# EAGLE design ember_power_v2 (EAGLE 5.11)
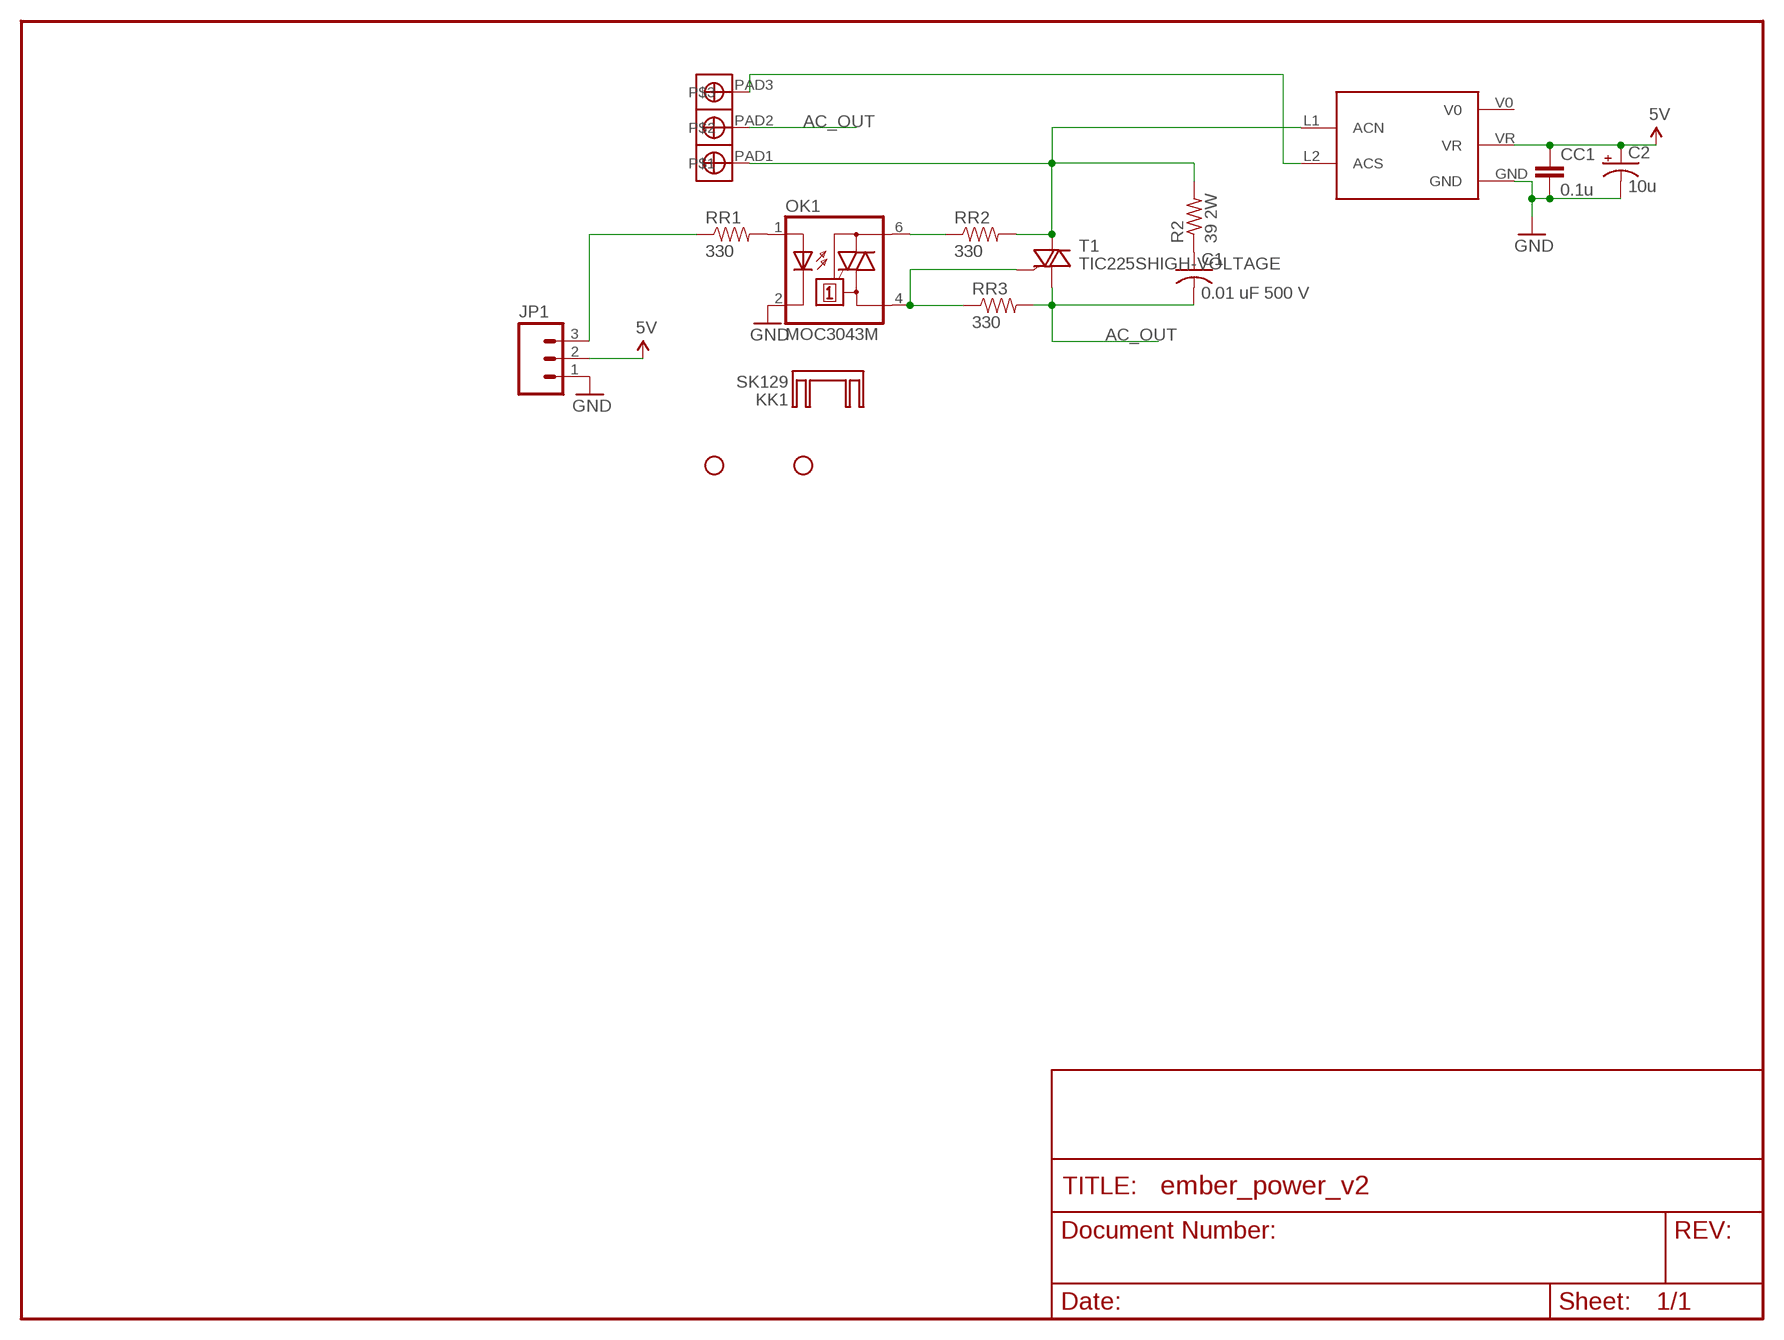
[diagram p0: schematic, sheet 1]

## Parts
C1  0.01 uF 500 V  C-US102-043X133  [C102-043X133]
C2  10u  CAP_POLPTH2  [CPOL-RADIAL-10UF-25V]
CC1  0.1u  CAPPTH  [CAP-PTH-SMALL]
JP1  M03LOCK  [1X03_LOCK]
JP5  STAND-OFF  [STAND-OFF]
JP6  STAND-OFF  [STAND-OFF]
KK1  SK129  [SK129-HOLE]
OK1  MOC3043M  [DIL06]
R2  39 2W  R-US_0411/15  [0411/15]
RR1  330  RESISTORPTH-1/4W  [AXIAL-0.4]
RR2  330  RESISTORPTH-1/4W  [AXIAL-0.4]
RR3  330  RESISTORPTH-1/4W  [AXIAL-0.4]
T1  TIC225SHIGH-VOLTAGE  [TO220DSH]
U$2  TE-BARRIER-3  [TE-BARRIER-.325]
U$3  POWER_SUPPLY  [BIAS_PWR_1W]

## Nets
5V: C2.1(+) CC1.1 JP1.2 U$3.VR
AC_OUT: C1.2 RR3.P$2 T1.A1 U$2.PAD2
GND: C2.2(-) CC1.2 JP1.1 OK1.2(C) U$3.GND
N$1: JP1.3 RR1.P$1
N$2: U$2.PAD3 U$3.L2(ACS)
N$3: OK1.1(A) RR1.P$2
N$4: OK1.6(A2) RR2.P$1
N$14: OK1.4(A1) RR3.P$1 T1.G
N$17: C1.1 R2.1
N$38 [1A/150]: R2.2 RR2.P$2 T1.A2 U$2.PAD1 U$3.L1(ACN)
Unconnected: U$3.V0

## Library data of the parts
C1 = rcl:C-US: CAPACITOR, American symbol
C2 = SparkFun:CAP_POL: Capacitor Polarized These are standard SMD and PTH capacitors. Normally 10uF, 47uF, and 100uF in electrolytic and tantalum varieties. Always verify the external diameter of the through hole cap, it varies with capacity, voltage, and manufacturer. The EIA devices should be standard.
CC1 = SparkFun:CAP: Capacitor Standard 0603 ceramic capacitor, and 0.1" leaded capacitor.
JP1 = SparkFun:M03: Header 3 Standard 3-pin 0.1" header. Use with straight break away headers (SKU : PRT-00116), right angle break away headers (PRT-00553), swiss pins (PRT-00743), machine pins (PRT-00117), and female headers (PRT-00115). Molex polarized connector foot print use with SKU : PRT-08232 with associated crimp pins and housings.
JP5 JP6 = SparkFun:STAND-OFF: Stand Off This is the mechanical footprint for a #4 phillips button head screw. Use the keepout ring to avoid running the screw head into surrounding components. SKU : PRT-00447
KK1 = heatsink:SK129: HEATSINK manufacturer Fischer/distributor Buerklin
OK1 = optocoupler:MOC30*: 6-Pin DIP Zero-Cross Optoisolators Triac Driver Output (250/400 Volt Peak) Source: http://www.fairchildsemi.com/ds/MO/MOC3043-M.pdf; MF: FAIRCHILD SEMICONDUCTOR; MPN: MOC3043-M; OC_FARNELL: 1021371; OC_NEWARK: 72K8900
R2 = User:R-US_: RESISTOR, American symbol
RR1-RR3 = SparkFun:RESISTOR: Resistor Basic schematic elements and footprints for 0603, 1206, and PTH resistors.
T1 = User:TIC225S: TRIAC
U$2 = User:TE-BARRIER-3
U$3 = User:POWER_SUPPLY

## Net classes
1 10A/150: width 2.54 mm, clearance 1.854 mm
2 1A/150: width 0.102 mm, clearance 1.854 mm

## Board
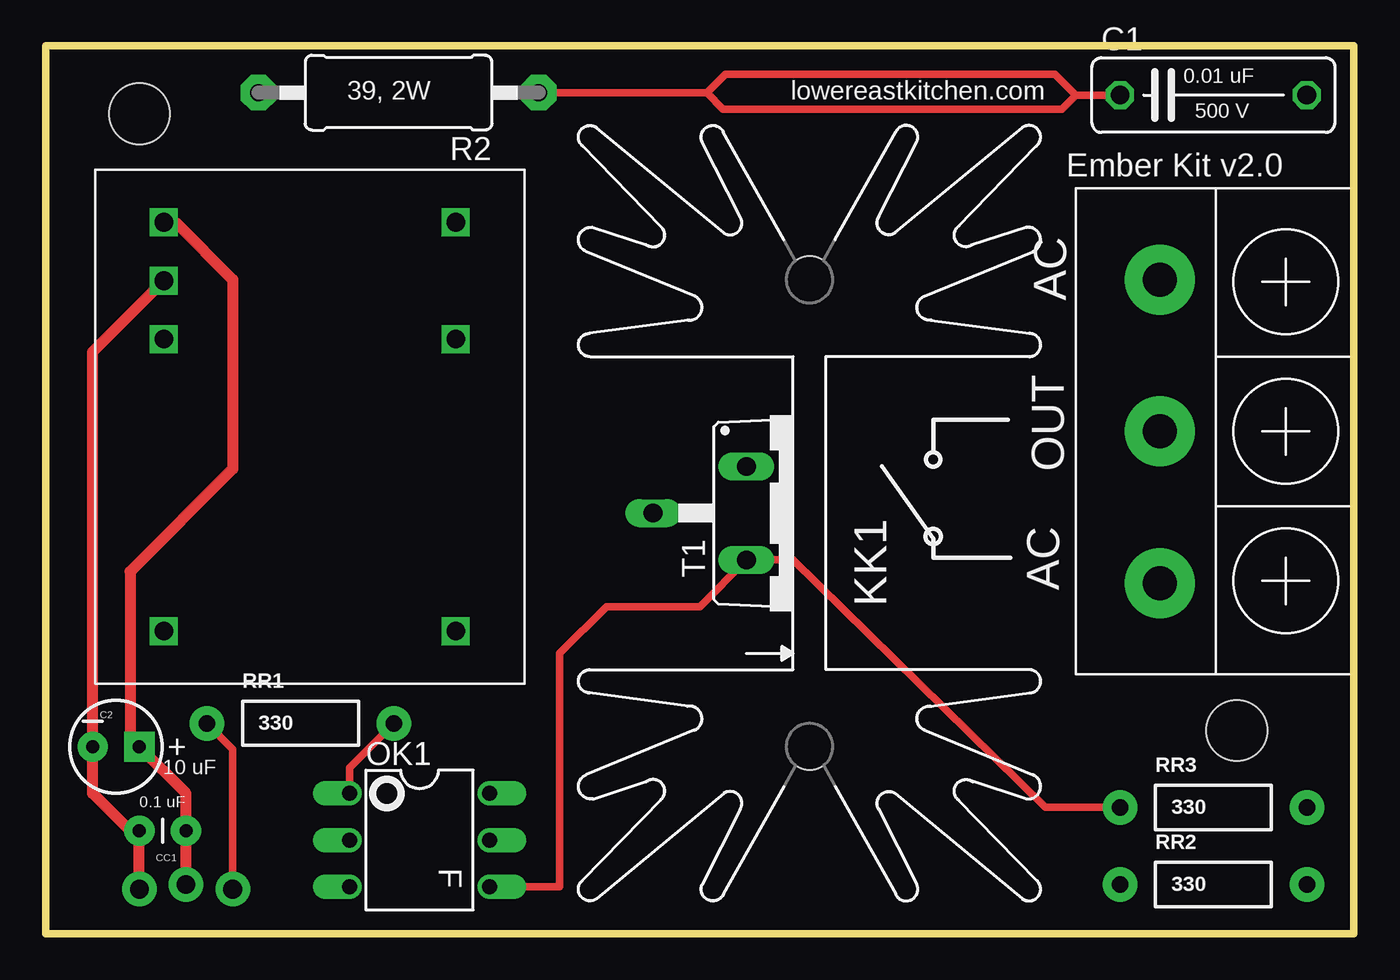
[diagram p1: board, top side]
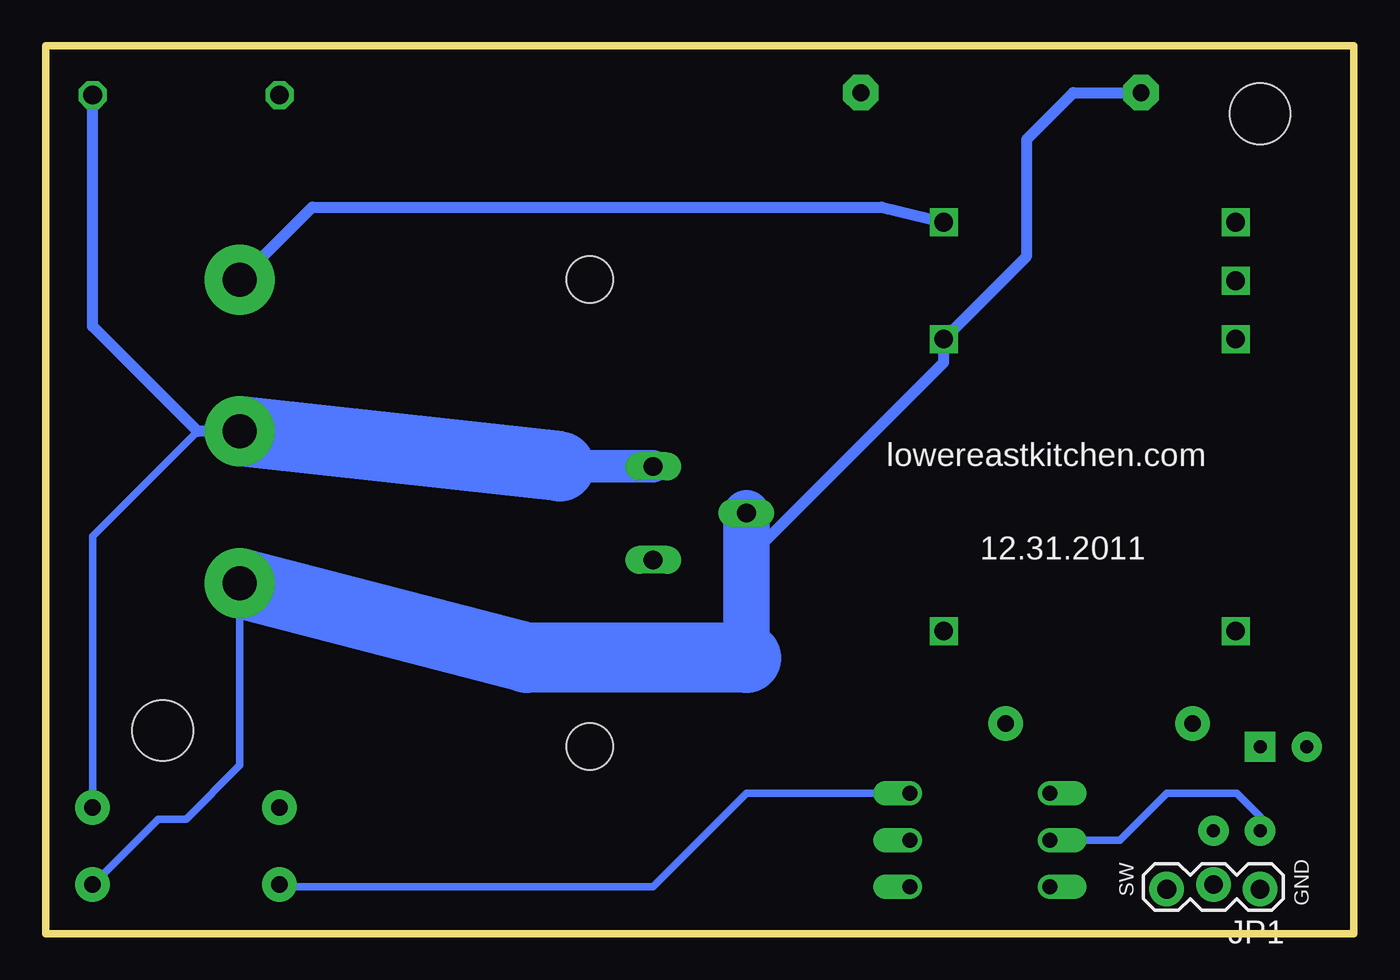
[diagram p2: board, bottom side, seen from below]

Size 71.12 x 48.26 mm. Coordinates in mm from the lower left corner, seen from the top.
Outline: 0,48.26 0,0 71.12,0 71.12,48.26 0,48.26
Copper layers (1*16): Top 0.035mm / dielectric 1.5mm / Bottom 0.035mm
Design rules "default *": minimum track width 10mil, minimum drill 24mil, track to track 8mil, track to pad 8mil, pad to pad 8mil, via to via 8mil, smd to smd 8mil, copper to edge 40mil, drill to drill 8mil, minimum pad ring 10mil, minimum via ring 8mil, stop-mask expansion 4mil, vias tented up to drill 25mil, thermal gap 10mil

### Footprints (pad centres in the part's own frame; a part is rotated, then mirrored left to right if it is on the bottom)
C102-043X133 = drill 1.016 octagon: 1 -5.08,0; 2 5.08,0
CPOL-RADIAL-10UF-25V = drill 0.7 pad 1.651 square: 1 1.27,0 | drill 0.7 pad 1.651 round: 2 -1.27,0
CAP-PTH-SMALL = drill 0.7 pad 1.651 round: 1 0,0; 2 2.54,0
1X03_LOCK = drill 1.016 pad 1.88 round: 1 0,0.127; 2 2.54,-0.127; 3 5.08,0.127
STAND-OFF = hole 3.302: 0,0
SK129-HOLE = hole 2.54: -12.7,-0.889; 12.7,-0.889
DIL06 = drill 0.813 offset: 1 -2.54,-3.81; 2 0,-3.81; 3 2.54,-3.81; 4 2.54,3.81; 5 0,3.81; 6 -2.54,3.81
0411/15 = drill 0.914 pad 1.93 octagon: 1 -7.62,0; 2 7.62,0
AXIAL-0.4 = drill 0.9 pad 1.88 round: P$1 -5.08,0; P$2 5.08,0
TO220DSH = drill 1.016 long: A1 -2.54,-2.54; A2 0,-7.62; G 2.54,-2.54
TE-BARRIER-.325 = drill 1.854 pad 3.81 round: PAD1 8.255,-3.048; PAD2 0,-3.048; PAD3 -8.255,-3.048
BIAS_PWR_1W = drill 1.016 square: GND 7.938,7.938; L1 4.763,-7.938; L2 11.113,-7.938; NC1 -11.113,7.938; NC2 -11.113,-7.938; V0 4.763,7.938; VR 11.113,7.938

### Placement (x,y rotation side)
C1  63.5,45.59 0 top
C2  3.81,10.16 0 top
CC1  7.62,5.59 180 top
JP1  5.08,2.54 180 bottom
JP5  64.77,11.05 0 top
JP6  5.08,44.58 0 top
KK1  40.64,22.86 90 top
OK1  20.32,5.08 270 top
R2  19.18,45.72 180 top
RR1  13.84,11.43 0 top
RR2  63.5,2.67 0 top
RR3  63.5,6.86 0 top
T1  40.64,22.86 270 top
U$2  63.63,27.3 270 top
U$3  14.35,27.56 90 top

### Tracks (layer width: path | path; a pad name or v marks a point on that pad's centre or on a via)
5V
  Top 0.61: JP1.2 CC1.1 7.62,7.62 C2.1 4.57,10.67 4.57,19.68 10.16,25.27 10.16,35.56 7.05,38.67 U$3.VR
AC_OUT
  Bottom 0.406: RR3.P$2 68.58,21.59 62.87,27.3
  Bottom 0.61: U$2.PAD2 62.87,27.3 68.58,33.02 C1.2
  Bottom 1.778: T1.A1 43.18,25.4
  Bottom 3.81: 43.18,25.4 U$2.PAD2
GND
  Top 0.61: JP1.1 CC1.2 4.57,5.59 2.54,7.62 C2.2 2.54,31.62 U$3.GND
  Bottom 0.406: CC1.2 5.08,6.35 6.35,7.62 10.16,7.62 12.7,5.08 OK1.2
  Bottom 0.61: OK1.2 16.26,5.33
N$1
  Top 0.406: JP1.3 10.16,10.03 RR1.P$1
N$2
  Bottom 0.61: U$2.PAD3 56.64,39.5 25.65,39.5 U$3.L2
N$3
  Top 0.406: OK1.1 16.51,9.02 RR1.P$2
N$4
  Bottom 0.406: OK1.6 33.02,7.62 38.1,2.54 58.29,2.54 RR2.P$1
N$14
  Top 0.406: RR3.P$1 54.36,6.86 40.64,20.32 T1.G 35.56,17.78 30.48,17.78 27.94,15.24 27.94,2.54 OK1.4
N$17
  Top 0.406: 35.94,45.72 36.83,44.83 55.24,44.83 56.01,45.59 C1.1 | R2.1 35.94,45.72 | 35.94,45.72 36.96,46.74 54.86,46.74 55.88,45.72
N$38
  Bottom 0.406: U$2.PAD1 60.58,9.14 63.5,6.22 65.02,6.22 RR2.P$2
  Bottom 0.61: R2.2 15.24,45.72 17.78,43.18 17.78,36.83 U$3.L1 22.29,31.05 33.02,20.32
  Bottom 2.54: 33.02,14.99 33.02,20.32 T1.A2
  Bottom 3.81: U$2.PAD1 44.96,14.99 33.02,14.99

### Text on the board
tPlace: lowereastkitchen.com | 0.01 uF | 39, 2W | 500 V | Ember Kit v2.0 | AC | OUT | AC | + | 10 uF | 0.1 uF | F
bPlace: lowereastkitchen.com | 12.31.2011 | GND | SW